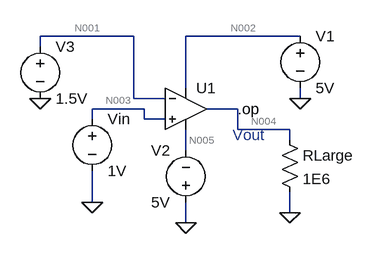
[diagram p0: schematic Draft1.asc]
Draft1.asc, the LTspice schematic file:
Version 4
SHEET 1 880 680
WIRE 128 -32 -16 -32
WIRE 384 -32 208 -32
WIRE -16 -16 -16 -32
WIRE 208 48 208 -32
WIRE 128 64 128 -32
WIRE 176 64 128 64
WIRE 384 64 384 48
WIRE 144 80 64 80
WIRE 288 80 240 80
WIRE 64 96 64 80
WIRE 144 96 144 80
WIRE 176 96 144 96
WIRE 288 112 288 80
WIRE 368 112 288 112
WIRE 368 128 368 112
WIRE 208 144 208 112
WIRE 64 224 64 176
WIRE 368 240 368 208
WIRE 208 256 208 224
FLAG 64 224 0
FLAG 208 256 0
FLAG 384 64 0
FLAG 368 240 0
FLAG -16 64 0
DATAFLAG 368 112 "round($*100)/100"
SYMBOL voltage 64 80 R0
WINDOW 123 0 0 Left 0
WINDOW 39 0 0 Left 0
SYMATTR InstName Vin
SYMATTR Value 1V
SYMBOL Opamps\\UniversalOpamp2 208 80 R0
SYMATTR InstName U1
SYMBOL res 352 112 R0
SYMATTR InstName RLarge
SYMATTR Value 1E6
SYMBOL voltage 208 240 R180
WINDOW 0 24 96 Left 2
WINDOW 3 24 16 Left 2
WINDOW 123 0 0 Left 0
WINDOW 39 0 0 Left 0
SYMATTR InstName V2
SYMATTR Value 5V
SYMBOL voltage 384 -48 R0
WINDOW 123 0 0 Left 0
WINDOW 39 0 0 Left 0
SYMATTR InstName V1
SYMATTR Value 5V
SYMBOL voltage -16 -32 R0
WINDOW 123 0 0 Left 0
WINDOW 39 0 0 Left 0
SYMATTR InstName V3
SYMATTR Value 1.5V
TEXT 288 80 Left 2 !.op
TEXT 280 120 Left 2 ;Vout

The netlist it stands for:
* Draft1.asc
Vin N003 0 1V
XU1 N003 N001 N002 N005 N004 level.2 Avol=1Meg GBW=10Meg Slew=10Meg ilimit=25m rail=0 Vos=0 phimargin=45 en=0 enk=0 in=0 ink=0 Rin=500Meg  ; pins IN+ IN- V+ V- OUT
RLarge N004 0 1E6
V2 0 N005 5V
V1 N002 0 5V
V3 N001 0 1.5V
.op
* Vout
.lib UniversalOpamps2.sub
.backanno
.end

* Results of the author's LTspice run, read from the files saved beside the schematic
* Operating Point:
*   V(n003) = 1 V
*   V(n004) = -5 V
*   V(n002) = 5 V
*   V(n005) = -5 V
*   V(n001) = 1.5 V
*   I(Rlarge) = -5 µA
*   I(V3) = -3 nA
*   I(V1) = -1.175 µA
*   I(V2) = -6.08 µA
*   I(Vin) = -2 nA
*   Ix(u1:1) = 2 nA
*   Ix(u1:2) = 3 nA
*   Ix(u1:3) = 1.175 µA
*   Ix(u1:4) = -6.08 µA
*   Ix(u1:5) = 5 µA